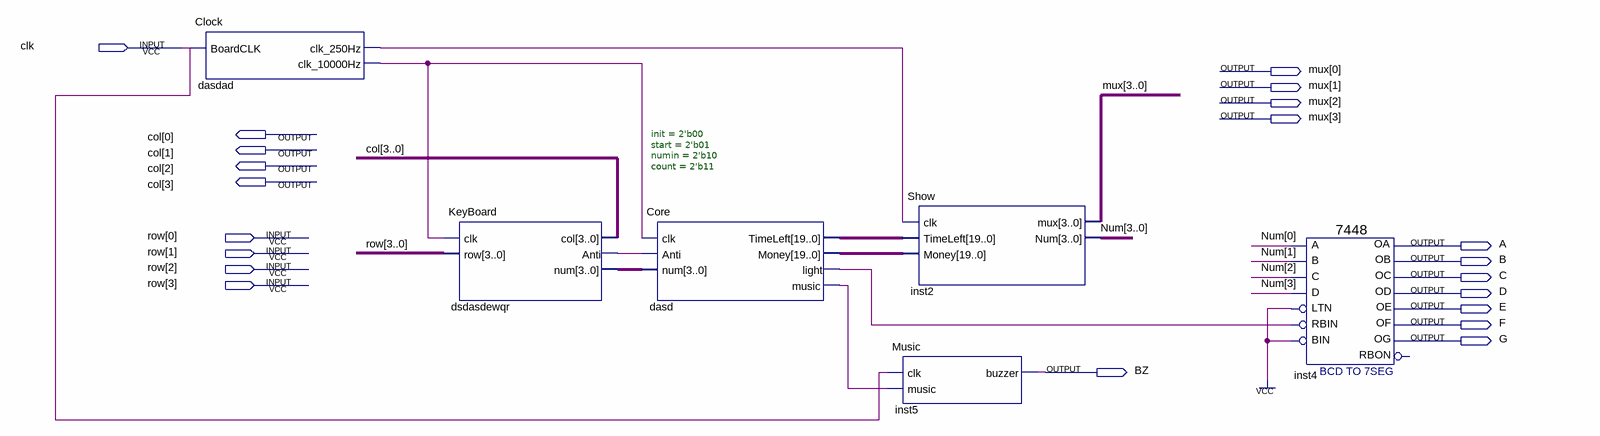
[diagram p0: schematic sheet]
// Quartus schematic FINAL.bdf as structural Verilog: 6 symbols, 21 pins
module FINAL (
  input  clk,
  input  [3:0] row,
  output [3:0] mux,
  output [3:0] col,
  output A,
  output B,
  output C,
  output D,
  output E,
  output F,
  output G,
  output BZ
);

  wire dasd_light, dasd_music, dasdad_clk_250hz, dasdad_clk_10000hz, dsdasdewqr_anti;
  wire [3:0] dsdasdewqr_num, Num;
  wire [19:0] dasd_money, dasd_timeleft;

  Clock dasdad (.BoardCLK(clk), .clk_250Hz(dasdad_clk_250hz), .clk_10000Hz(dasdad_clk_10000hz));
  KeyBoard dsdasdewqr (.clk(dasdad_clk_10000hz), .row(row), .col(col), .Anti(dsdasdewqr_anti), .num(dsdasdewqr_num));
  Core #(.init(2'b00), .start(2'b01), .numin(2'b10), .count(2'b11)) dasd (
    .clk(dasdad_clk_10000hz), .Anti(dsdasdewqr_anti), .num(dsdasdewqr_num), .TimeLeft(dasd_timeleft),
    .Money(dasd_money), .light(dasd_light), .music(dasd_music));
  Show inst2 (.clk(dasdad_clk_250hz), .TimeLeft(dasd_timeleft), .Money(dasd_money), .mux(mux), .Num(Num));
  Music inst5 (.clk(clk), .music(dasd_music), .buzzer(BZ));
  \7448  inst4 (
    .A(Num[0]), .C(Num[2]), .D(Num[3]), .B(Num[1]), .RBIN(dasd_light), .BIN(1'b1), .LTN(1'b1), .OC(C),
    .OE(E), .OD(D), .OF(F), .OG(G), .OB(B), .OA(A));  // open: RBON
endmodule
